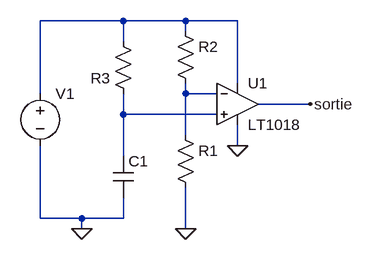
[diagram p0: schematic RC Timer circuit.asc]
RC Timer circuit.asc, the LTspice schematic file:
Version 4
SHEET 1 880 680
WIRE 256 -64 128 -64
WIRE 352 -64 256 -64
WIRE 432 -64 352 -64
WIRE 352 -48 352 -64
WIRE 256 -32 256 -64
WIRE 432 32 432 -64
WIRE 128 48 128 -64
WIRE 352 48 352 32
WIRE 400 48 352 48
WIRE 544 64 464 64
WIRE 256 80 256 48
WIRE 400 80 256 80
WIRE 352 112 352 48
WIRE 432 128 432 96
WIRE 256 144 256 80
WIRE 128 240 128 128
WIRE 192 240 128 240
WIRE 256 240 256 208
WIRE 256 240 192 240
WIRE 192 256 192 240
WIRE 352 256 352 192
FLAG 192 256 0
FLAG 432 128 0
FLAG 544 64 sortie
FLAG 352 256 0
SYMBOL voltage 128 32 R0
WINDOW 123 0 0 Left 0
WINDOW 39 0 0 Left 0
SYMATTR InstName V1
SYMATTR Value ""
SYMBOL res 272 64 R180
WINDOW 3 36 19 Left 2
SYMATTR InstName R3
SYMATTR Value ""
SYMBOL cap 240 144 R0
SYMATTR InstName C1
SYMATTR Value ""
SYMBOL Comparators\\LT1018 432 64 R0
SYMATTR InstName U1
SYMBOL res 336 -64 R0
SYMATTR InstName R2
SYMATTR Value ""
SYMBOL res 336 96 R0
SYMATTR InstName R1
SYMATTR Value ""

The netlist it stands for:
* RC Timer circuit.asc
V1 N001 0
R3 N003 N001
C1 N003 0
XU1 N003 N002 N001 0 sortie LT1018  ; pins In+ In- V+ V- OUT
R2 N001 N002
R1 N002 0
.lib LTC1.lib
.backanno
.end